# Altium project MQP_PCB_PM.PrjPcb
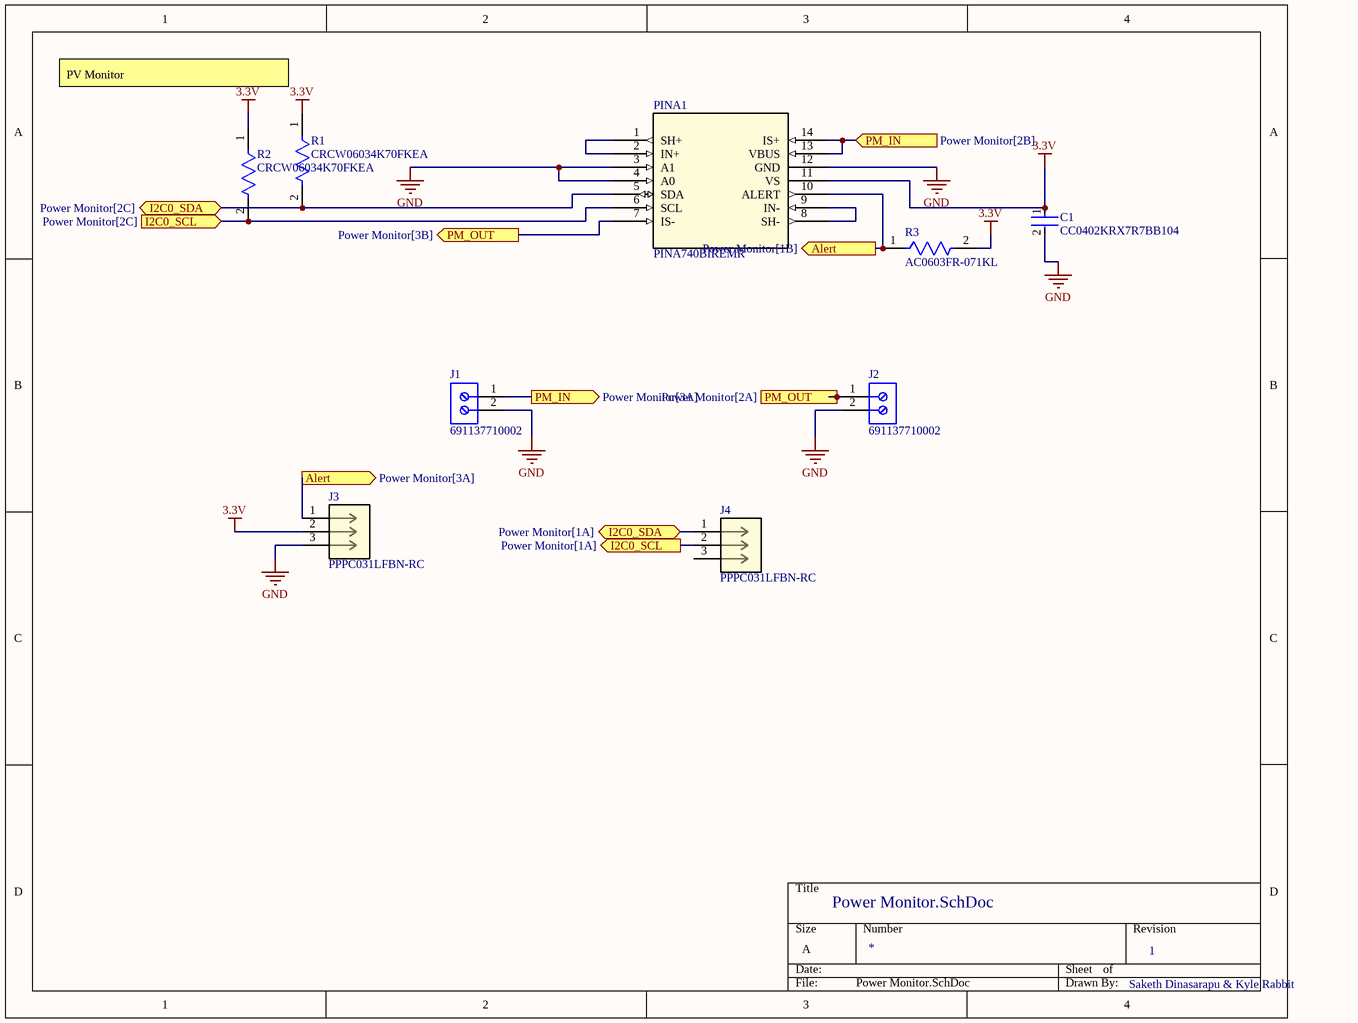
[diagram p0: Power Monitor.SchDoc]
Author: Kyle Rabbitt; Revision: 1
1 sheet, 9 parts. Net scope: flat (ports and power ports of the same name join across sheets).
Board file: PCB_PowerMonitor.PcbDoc

## Sheet Power Monitor.SchDoc
size A; SheetNumber: 1; SheetTotal: 1

### Parts
C1  CC0402KRX7R7BB104  [FP-CC0402-MFG]
J1  691137710002  [691137710002]
J2  691137710002  [691137710002]
J3  PPPC031LFBN-RC  [CONN_PPPC031LFBN-RC_SUL]
J4  PPPC031LFBN-RC  [CONN_PPPC031LFBN-RC_SUL]
PINA1  PINA740BIREMR  [VQFN14_REM_TEX]
R1  CRCW06034K70FKEA  [FP-CRCW0603-e3-IPC_A]
R2  CRCW06034K70FKEA  [FP-CRCW0603-e3-IPC_A]
R3  AC0603FR-071KL  [FP-AC0603-IPC_B]

### Ports
Alert (out, see Power Monitor[1B]), Alert (out, see Power Monitor[3A]), I2C0_SCL (in, see Power Monitor[2C]), I2C0_SCL (out, see Power Monitor[1A]), I2C0_SDA (bidir, see Power Monitor[1A]), I2C0_SDA (bidir, see Power Monitor[2C]), PM_IN (in, see Power Monitor[2B]), PM_IN (out, see Power Monitor[3A]), PM_OUT (in, see Power Monitor[2A]), PM_OUT (out, see Power Monitor[3B])

### Nets
3.3V: C1.1 J3.2 PINA1.11(VS) R1.1 R2.1 R3.2
GND: C1.2 J1.2 J2.2 J3.3 PINA1.3(A1) PINA1.4(A0) PINA1.12(GND)
NetJ1_1: J1.1 PINA1.13(VBUS) PINA1.14(IS+) ; port PM_IN
NetJ2_1: J2.1 PINA1.7(IS-) ; port PM_OUT
NetJ3_1: J3.1 PINA1.10(ALERT) R3.1 ; port Alert
NetJ4_1: J4.1 PINA1.5(SDA) R1.2 ; port I2C0_SDA
NetJ4_2: J4.2 PINA1.6(SCL) R2.2 ; port I2C0_SCL
NetPINA1_1: PINA1.1(SH+) PINA1.2(IN+)
NetPINA1_8: PINA1.8(SH-) PINA1.9(IN-)

Not connected (* = marked no-connect by the designer): J4 3

### Notes on the sheet
- PV Monitor
- Saketh Dinasarapu & Kyle Rabbit

### Library data of the parts
C1 = CMP-03422-000048-1: CAP CER 0.1UF 16V X7R 0402; Manufacturer: YAGEO; Material: Ceramic; Automotive Grade: NA; Capacitance: 100 nF; Temperature Coefficient: 30ppm/°C; Tolerance: 0.1; Value: 100 nF; Device Class L1: Passive Components; Temperature Range Low: -55°C; Device Class L3: Ceramic Capacitors; Temperature Characteristic: X7R; Ipc Land Pattern Name: CAPC10050X50; Temperature Range High: +125°C; Voltage Rating: 16 V; Temperature: -55°C to +125°C; RoHS: TRUE; Automotive: No; Height: 0.55mm; Device Class L2: Capacitors; Digikey Description: CAP CER 0.1UF 16V X7R 0402; Package: CC0402; Footprint Url: http://www.yageo.com/exep/pages/download/literatures/UPY-C_GEN_24.pdf; ComponentLink2Description: Datasheet; Category: Cap; Lead Free: Yes; Octopart: https://octopart.com/cc0402krx7r7bb104-yageo-42244624; ComponentLink2URL: http://www.yageo.com/documents/recent/UPY-GP_NP0_16V-to-50V_16.pdf; Manufacturer Part Number: CC0402KRX7R7BB104; Mouser Description: 0402 0.1 uF 16 V ±10 % Tolerance X7R SMT Multilayer Ceramic Capacitor
J1 J2 = CMP-1502-03324-2: NexarPartId: 78871135; Voltage Rating: 300V; Number of Contacts: 2; Current Rating: 16A; Lead Pitch: 5mm; Height: 11.6mm; Packaging: Box; RoHS: Non-Compliant; Contact Material: Nickel, Tin; Max Operating Temperature: 120°C; Number of Pins: 2; Min Operating Temperature: -30°C; Number of Rows: 1
J3 J4 = PPPC031LFBN-RC: No Description Available; Mfr_Name: Sullins; RefDes: RefDes; Type: Type
PINA1 = PINA740BIREMR: No Description Available; Mfr_Name: Texas Instruments; Type: Linear; RefDes: RefDes
R1 R2 = CMP-1666-00019-3: RES Thick Film, 4.7kΩ, 1%, 0.1W, 100ppm/°C, 0603; Resistance: 4.7kR; Voltage Rating: 75V; Power Rating: 100mW; Case Code (Metric): 1608; Military Standard: Not; Packaging: Tape and Reel; Termination: SMD/SMT; Temperature Coefficient: 100ppm/°C; Lead Free: Lead Free; Length: 1.55mm; Width: 0.85mm; Height: 0.45mm; Depth: 0.85mm; Weight: 7.1E-05oz; Case Code (Imperial): 0603; Contact Plating: Tin; Case/Package: 0603; Max Operating Temperature: 155°C; Mount: Surface Mount; Tolerance: 1%; Min Operating Temperature: -55°C; Package Quantity: 5000; Voltage Rating (DC): 75V; Composition: Thick Film
R3 = CMP-2000-04828-3: RES 1kΩ 1.00% 0.1W 0603; Voltage Rating: 50V; Power Rating: 100mW; Tolerance: 1%; Temperature Coefficient: 100ppm/°C; Resistance: 1kR; Depth: 0.8mm; Case/Package: 0603; Size Code: 0603; Case Code (Metric): 1608; Height: 0.022inch; Series: AC; Width: 0.031inch; Construction: Rectangular; Length: 0.063inch; Case Code (Imperial): 0603; Package Quantity: 1; RoHS Compliant: Yes; Features: Moisture Resistant; Resistor Type: Thick Film; Max Power Dissipation: 100mW; Packaging: Tape and Reel; Termination: SMD/SMT; Ratings: AEC-Q200; Max Operating Temperature: 155°C; Min Operating Temperature: -55°C; Military Standard: Not; Lead Free: Lead Free; Number of Terminations: 2